# Altium schematic sheet 17_SD_CARD.SchDoc: =TitleParameter
size A3; Address: Crete IL; Organization: ASISGUARD; Address1: Kemalpasa, Kemalpasa Cd. No:290 D:292H, 35060 Bornova/Izmir/Turkey
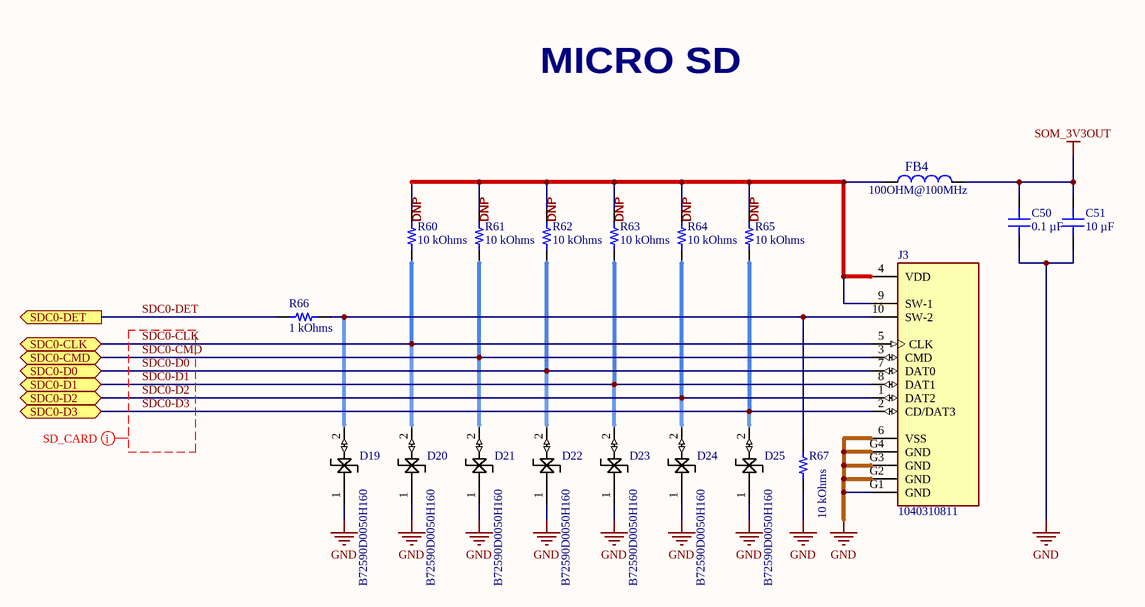
[diagram p0: 17_SD_CARD.SchDoc]

## Parts
C50  0.1 µF  [CAP 0603_1608]
C51  10 µF  [CAP 0603_1608]
D19  B72590D0050H160  [SOD1005X60N]
D20  B72590D0050H160  [SOD1005X60N]
D21  B72590D0050H160  [SOD1005X60N]
D22  B72590D0050H160  [SOD1005X60N]
D23  B72590D0050H160  [SOD1005X60N]
D24  B72590D0050H160  [SOD1005X60N]
D25  B72590D0050H160  [SOD1005X60N]
FB4  100OHM@100MHz  [FB 0603(1608)]
J3  1040310811  [MOLEX_104031-0811]
R60  10 kOhms  [RES 0402_1005]
R61  10 kOhms  [RES 0402_1005]
R62  10 kOhms  [RES 0402_1005]
R63  10 kOhms  [RES 0402_1005]
R64  10 kOhms  [RES 0402_1005]
R65  10 kOhms  [RES 0402_1005]
R66  1 kOhms  [RES 0402_1005]
R67  10 kOhms  [RES 0402_1005]

## Ports
SDC0-CLK (bidir), SDC0-CMD (bidir), SDC0-D0 (bidir), SDC0-D1 (bidir), SDC0-D2 (bidir), SDC0-D3 (bidir), SDC0-DET (out)

## Nets
GND: C50.1 C51.1 D19.1(GND) D20.1(GND) D21.1(GND) D22.1(GND) D23.1(GND) D24.1(GND) D25.1(GND) J3.6(VSS) J3.G1(GND) J3.G2(GND) J3.G3(GND) J3.G4(GND) R67.1
SOM_3V3OUT: C50.2 C51.2 FB4.1
SDC0-CLK: D20.2(I/OLINE) J3.5(CLK) R60.1 ; port SDC0-CLK
SDC0-CMD: D21.2(I/OLINE) J3.3(CMD) R61.1 ; port SDC0-CMD
SDC0-D0: D22.2(I/OLINE) J3.7(DAT0) R62.1 ; port SDC0-D0
SDC0-D1: D23.2(I/OLINE) J3.8(DAT1) R63.1 ; port SDC0-D1
SDC0-D2: D24.2(I/OLINE) J3.1(DAT2) R64.1 ; port SDC0-D2
SDC0-D3: D25.2(I/OLINE) J3.2(CD/DAT3) R65.1 ; port SDC0-D3
SDC0-DET: R66.1 ; port SDC0-DET
NetD19_2: D19.2(I/OLINE) J3.10(SW-2) R66.2 R67.2
NetFB4_2: FB4.2 J3.4(VDD) J3.9(SW-1) R60.2 R61.2 R62.2 R63.2 R64.2 R65.2

## Layout directives
net class SD_CARD: SDC0-CLK, SDC0-CMD, SDC0-D0, SDC0-D1, SDC0-D2, SDC0-D3

## Notes on the sheet
- MICRO SD
- (near R60) DNP
- (near R61) DNP
- (near R62) DNP
- (near R63) DNP
- (near R64) DNP
- (near R65) DNP
- Proje/Project:
- Sayfa Adı/Document Name:
- Çizilme Tarihi/Drawing Date
- Umit KAYACIK
- Tasarlayan/Designed By
- Sayfa/Sheet:
- Revision:
- of
- Son Güncelleme/Last Edit Date
- Kontrol eden/Checked By
- Onaylayan/Approved By
- Boyut/Size:
- Varyant/Variant:
- Dil/Language:
- A3
- ENG

## Library data of the parts
C50 = VJ0603Y104KXAPW1BC: CAP CER 0.1UF 50V X7R 0603; manufacturer: Vishay Vitramon; Tolerance: ±10%; Part Number: VJ0603Y104KXAPW1BC; Value: 0.1 µF; Applications: General Purpose; Capacitance: 0.1 µF; componentlink2description: DigiKey Link; componentlink2url: https://www.digikey.com/en/products/detail/vishay-vitramon/VJ0603Y104KXAPW1BC/10670836; Device Package: 0603 (1608 Metric); lastupdated: 2/9/2024 8:09:50 PM; Lifecycle Status: Active; Minimum Order: 1; Mounting Type: Surface Mount, MLCC; Operating Temperature: -55°C ~ 125°C; Package / Case: 0603 (1608 Metric); packaging: TapeAndReel; partid: 45127; Part Status: Active; price: 0.02; series: VJ W1BC; Size / Dimension: 0.063" L x 0.031" W (1.60mm x 0.80mm); Supplier 1: DigiKey; Supplier Part Number 1: 720-VJ0603Y104KXAPW1BCCT-ND; Temperature Coefficient: X7R; Thickness (Max): 0.037" (0.95mm); Voltage - Rated: 50V
C51 = KGM15CR51C106KT: CAP CER 10UF 16V X5R 0603; manufacturer: KYOCERA AVX; Tolerance: ±10%; Part Number: KGM15CR51C106KT; Value: 10 µF; Applications: General Purpose; Capacitance: 10 µF; componentlink1description: Datasheet; componentlink1url: https://datasheets.kyocera-avx.com/cx5r.pdf; componentlink2description: DigiKey Link; componentlink2url: https://www.digikey.com/en/products/detail/kyocera-avx/KGM15CR51C106KT/17866320; Device Package: 0603 (1608 Metric); lastupdated: 2/9/2024 8:08:56 PM; Lifecycle Status: Active; Minimum Order: 1; Mounting Type: Surface Mount, MLCC; Operating Temperature: -55°C ~ 85°C; Package / Case: 0603 (1608 Metric); packaging: TapeAndReel; partid: 54717; Part Status: Active; price: 0.03; series: KGM - X5R; Size / Dimension: 0.063" L x 0.031" W (1.60mm x 0.80mm); Supplier 1: DigiKey; Supplier Part Number 1: 478-KGM15CR51C106KTCT-ND; Temperature Coefficient: X5R; Thickness (Max): 0.039" (1.00mm); Voltage - Rated: 16V
D19-D25 = B72590D0050H160: VARISTOR 150V 0402; Manufacturer: TDK EPCOS; Supplier 1: Digikey; Manufacturer Part Number: B72590D0050H160; RoHS: Yes; Category: Varistors; Stock 1: 130000; Pricing 1: 10000=0,04977, 30000=0,04666, 50000=0,04137, 100000=0,04044, 250000=0,03982 (USD); ComponentLink1URL: https://datasheet.octopart.com/B72590D0050H160-EPCOS-datasheet-10468447.pdf?src-supplier=Newark; ComponentLink1Description: https://datasheet.octopart.com/B72590D0050H160-EPCOS-datasheet-10468447.pdf?src-supplier=Newark; ComponentLink2URL: https://en.tdk.eu/inf/75/ds/High_speed_series.pdf?src-supplier=Verical; ComponentLink2Description: https://en.tdk.eu/inf/75/ds/High_speed_series.pdf?src-supplier=Verical; ComponentLink3URL: http://www.farnell.com/datasheets/1706828.pdf?src-supplier=Newark; ComponentLink3Description: http://www.farnell.com/datasheets/1706828.pdf?src-supplier=Newark; ComponentLink4URL: https://en.tdk.eu/inf/75/ds/High_speed_series.pdf?src-supplier=Digikey; ComponentLink4Description: https://en.tdk.eu/inf/75/ds/High_speed_series.pdf?src-supplier=Digikey; ComponentLink5URL: https://www.tdk-electronics.tdk.com/inf/75/ds/High_speed_series.pdf?src-supplier=Digikey; ComponentLink5Description: https://www.tdk-electronics.tdk.com/inf/75/ds/High_speed_series.pdf?src-supplier=Digikey; ComponentLink6URL: https://en.tdk.eu/inf/75/ds/High_speed_series.pdf?src-supplier=Arrow+Electronics; ComponentLink6Description: https://en.tdk.eu/inf/75/ds/High_speed_series.pdf?src-supplier=Arrow+Electronics; ComponentLink7URL: https://en.tdk.eu/inf/75/ds/High_speed_series.pdf?src-supplier=Quest; ComponentLink7Description: https://en.tdk.eu/inf/75/ds/High_speed_series.pdf?src-supplier=Quest; ComponentLink8URL: https://datasheet.octopart.com/B72590D0050H160-EPCOS-datasheet-157245974.pdf?src-supplier=LKR; ComponentLink8Description: https://datasheet.octopart.com/B72590D0050H160-EPCOS-datasheet-157245974.pdf?src-supplier=LKR; ComponentLink9URL: https://en.tdk.eu/inf/75/ds/High_speed_series.pdf?src-supplier=TTI; ComponentLink9Description: https://en.tdk.eu/inf/75/ds/High_speed_series.pdf?src-supplier=TTI; Supplier Part Number 1: 495-3684-2-ND
FB4 = FB0603_100OHM_100MHz: 100 Ohms @ 100 MHz 1 Power Line Ferrite Bead 0603 (1608 Metric) 2A 40mOhm; Manufacturer: TDK; Manufacturer Part Number: MPZ1608Y101BTA00; Tolerance: 25%; Impedance: 100R; DC Resistance (DCR): 40mR; ComponentLink1URL: https://chn-vm-apps.microchip.com/mchprepo/parts/Datasheets/beads_commercial_power_mpz_en.pdf; ComponentLink1Description: Datasheet; Supplier 1: Digi-Key; Supplier Part Number 1: 445-2984-1-ND; RoHS: Yes; Category: Ferrite Beads and Chips; Stock 1: 551; Pricing 1: 1=0,10000, 10=0,07200, 25=0,06480, 50=0,05840, 100=0,04290, 250=0,03120, 500=0,02860, 1000=0,02470 (USD); Mount: Surface Mount; Case/Package: 0603; Case Code (Metric): 1608; Case Code (Imperial): 0603; Core Material: Ferrite; Packaging: Tape and Reel; Package Quantity: 4000; Max DC Current: 2A; Current Rating: 2A; Series: MPZ; Length: 0.063inch; Width: 0.031inch; Height: 0.037inch; RoHS Compliant: Yes; REACH SVHC: No SVHC; ComponentLink2URL: https://datasheet.ciiva.com/46634/beads-commercial-power-mpz-en-46634677.pdf?src-supplier=Digi-Key; ComponentLink2Description: https://datasheet.ciiva.com/46634/beads-commercial-power-mpz-en-46634677.pdf?src-supplier=Digi-Key; ComponentLink3URL: https://datasheet.ciiva.com/48682/beads-commercial-power-mpz-en-48682501.pdf?src-supplier=Avnet; ComponentLink3Description: https://datasheet.ciiva.com/48682/beads-commercial-power-mpz-en-48682501.pdf?src-supplier=Avnet; ComponentLink4URL: https://datasheet.ciiva.com/46634/beads-commercial-power-mpz-en-46634684.pdf?src-supplier=Digi-Key; ComponentLink4Description: https://datasheet.ciiva.com/46634/beads-commercial-power-mpz-en-46634684.pdf?src-supplier=Digi-Key; ComponentLink5URL: https://datasheet.ciiva.com/46634/beads-commercial-power-mpz-en-46634621.pdf?src-supplier=Digi-Key; ComponentLink5Description: https://datasheet.ciiva.com/46634/beads-commercial-power-mpz-en-46634621.pdf?src-supplier=Digi-Key; Parameter 1: *; LCSC Manufacturer Part Number: MPZ1608Y101BTA00; LCSC Part Number: C501996
J3 = 1040310811: 1.10mm Pitch microSD Memory Card Connector, SMT, Push-Pull Type, 1.42mm Height, with Detect Switch; Manufacturer: Molex; Number of Contacts: 8; Gender: Female; Pitch: 1.1mm; Supplier 1: Digikey; Manufacturer Part Number: 1040310811; RoHS: Yes; Category: Memory Connectors; Stock 1: 36000; Pricing 1: 2000=1.20529, 4000=1.16372, 6000=1.10554 (USD); Mount: Surface Mount; Contact Material: Bronze; Contact Plating: Gold; Housing Material: Polymer; Min Operating Temperature: -25°C; Max Operating Temperature: 85°C; Number of Rows: 1; Orientation: Right Angle; Packaging: Tape and Reel; Termination: Solder; Number of Circuits: 8; Series: 103041; Length: 11.14mm; Width: 11.4mm; Depth: 11.4mm; Radiation Hardening: No; Halogen Free: Low Halogen; Reach SVHC Compliant: Unknown; ComponentLink1URL: https://datasheet.ciiva.com/4581/1040310811-memory-card-socket-153593-4581012.pdf?src-supplier=Mouser; ComponentLink1Description: https://datasheet.ciiva.com/4581/1040310811-memory-card-socket-153593-4581012.pdf?src-supplier=Mouser; ComponentLink2URL: https://datasheet.ciiva.com/683/1040310811-sd-683579.pdf?src-supplier=Digikey; ComponentLink2Description: https://datasheet.ciiva.com/683/1040310811-sd-683579.pdf?src-supplier=Digikey; ComponentLink3URL: https://datasheet.ciiva.com/16655/1040310811-memory-card-socket-16655292.pdf?; ComponentLink3Description: https://datasheet.ciiva.com/16655/1040310811-memory-card-socket-16655292.pdf?; ComponentLink4URL: https://datasheet.ciiva.com/3121/1040310811-memory-card-socket-3121437.pdf?src-supplier=Avnet; ComponentLink4Description: https://datasheet.ciiva.com/3121/1040310811-memory-card-socket-3121437.pdf?src-supplier=Avnet; ComponentLink5URL: https://datasheet.ciiva.com/683/1040310811-sd-683580.pdf?src-supplier=Digikey; ComponentLink5Description: https://datasheet.ciiva.com/683/1040310811-sd-683580.pdf?src-supplier=Digikey; ComponentLink6URL: https://datasheet.ciiva.com/683/1040310811-sd-683581.pdf?src-supplier=Digikey; ComponentLink6Description: https://datasheet.ciiva.com/683/1040310811-sd-683581.pdf?src-supplier=Digikey; ComponentLink7URL: https://datasheet.ciiva.com/15174/getdatasheetpartid-716154-15174887.pdf?src-supplier=Verical; ComponentLink7Description: https://datasheet.ciiva.com/15174/getdatasheetpartid-716154-15174887.pdf?src-supplier=Verical; Supplier Part Number 1: WM6357TR-ND
R60-R65 R67 = RP73PF1E10KBTD: RES 10K OHM 0.1% 1/10W 0402; Manufacturer: TE Connectivity Passive Product; Power (Watts): 0.1W, 1/10W; Temperature Coefficient: ±25ppm/°C; Part Number: RP73PF1E10KBTD; Value: 10 kOhms; ComponentLink1Description: Datasheet; ComponentLink1URL: https://www.te.com/commerce/DocumentDelivery/DDEController?Action=srchrtrv&DocNm=1773272&DocType=DS&DocLang=English; ComponentLink2Description: DigiKey Link; ComponentLink2URL: https://www.digikey.com/en/products/detail/te-connectivity-passive-product/RP73PF1E10KBTD/8260957; Composition: Thin Film; Device Package: 0402 (1005 Metric); Height - Seated (Max): 0.014" (0.35mm); LastUpdated: 2/9/2024 8:30:24 PM; Lifecycle Status: Active; Minimum Order: 1; Number of Terminations: 2; Operating Temperature: -55°C ~ 155°C; Package / Case: 0402 (1005 Metric); Packaging: TapeAndReel; PartId: 2434; Part Status: Active; Price: 0.08; Resistance: 10 kOhms; Series: RP73, Holsworthy; Size / Dimension: 0.039" L x 0.020" W (1.00mm x 0.50mm); Supplier 1: DigiKey; Supplier Part Number 1: A127415CT-ND; Supplier Device Package: 0402; Tolerance: ±0.1%
R66 = ERJ-U02D1001X: 0402 ANTI-SULFUR RES. , 0.5%, 1K; Manufacturer: Panasonic Electronic Components; Power (Watts): 0.1W, 1/10W; Temperature Coefficient: ±200ppm/°C; Part Number: ERJ-U02D1001X; Value: 1 kOhms; ComponentLink1Description: Datasheet; ComponentLink1URL: https://industrial.panasonic.com/cdbs/www-data/pdf/RDP0000/AOA0000C334.pdf; ComponentLink2Description: DigiKey Link; ComponentLink2URL: https://www.digikey.com/en/products/detail/panasonic-electronic-components/ERJ-U02D1001X/9365326; Composition: Thick Film; Device Package: 0402 (1005 Metric); Features: Anti-Sulfur, Automotive AEC-Q200; Height - Seated (Max): 0.016" (0.40mm); LastUpdated: 2/9/2024 8:28:26 PM; Lifecycle Status: Active; Minimum Order: 1; Number of Terminations: 2; Operating Temperature: -55°C ~ 155°C; Package / Case: 0402 (1005 Metric); Packaging: TapeAndReel; PartId: 81776; Price: 0.01; Ratings: AEC-Q200; Resistance: 1 kOhms; Series: ERJ-U02; Size / Dimension: 0.039" L x 0.020" W (1.00mm x 0.50mm); Supplier 1: DigiKey; Supplier Part Number 1: 10-ERJ-U02D1001XCT-ND; Supplier Device Package: 0402; Tolerance: ±0.5%